# Altium schematic sheet ECAT RJ45.SchDoc
size 431 x 279 mm; SheetNumber: 7; PageSetup: Record=PageOptions|CenterHorizontal=True|CenterVertical=True|PrintScale=0.96|XCorrection=1.00|YCorrection=1.00|PrintKind=1|BorderSize=5000000|LeftOffset=0|BottomOffset=0|Orientation=2|PaperLength=1000|PaperWidth=1000|Scale=100|PaperSource=258|PrintQuality=600|MediaType=1|DitherType=10|PaperKind=11x17|PrintScaleMode=1; CopyrightDate: 20xx
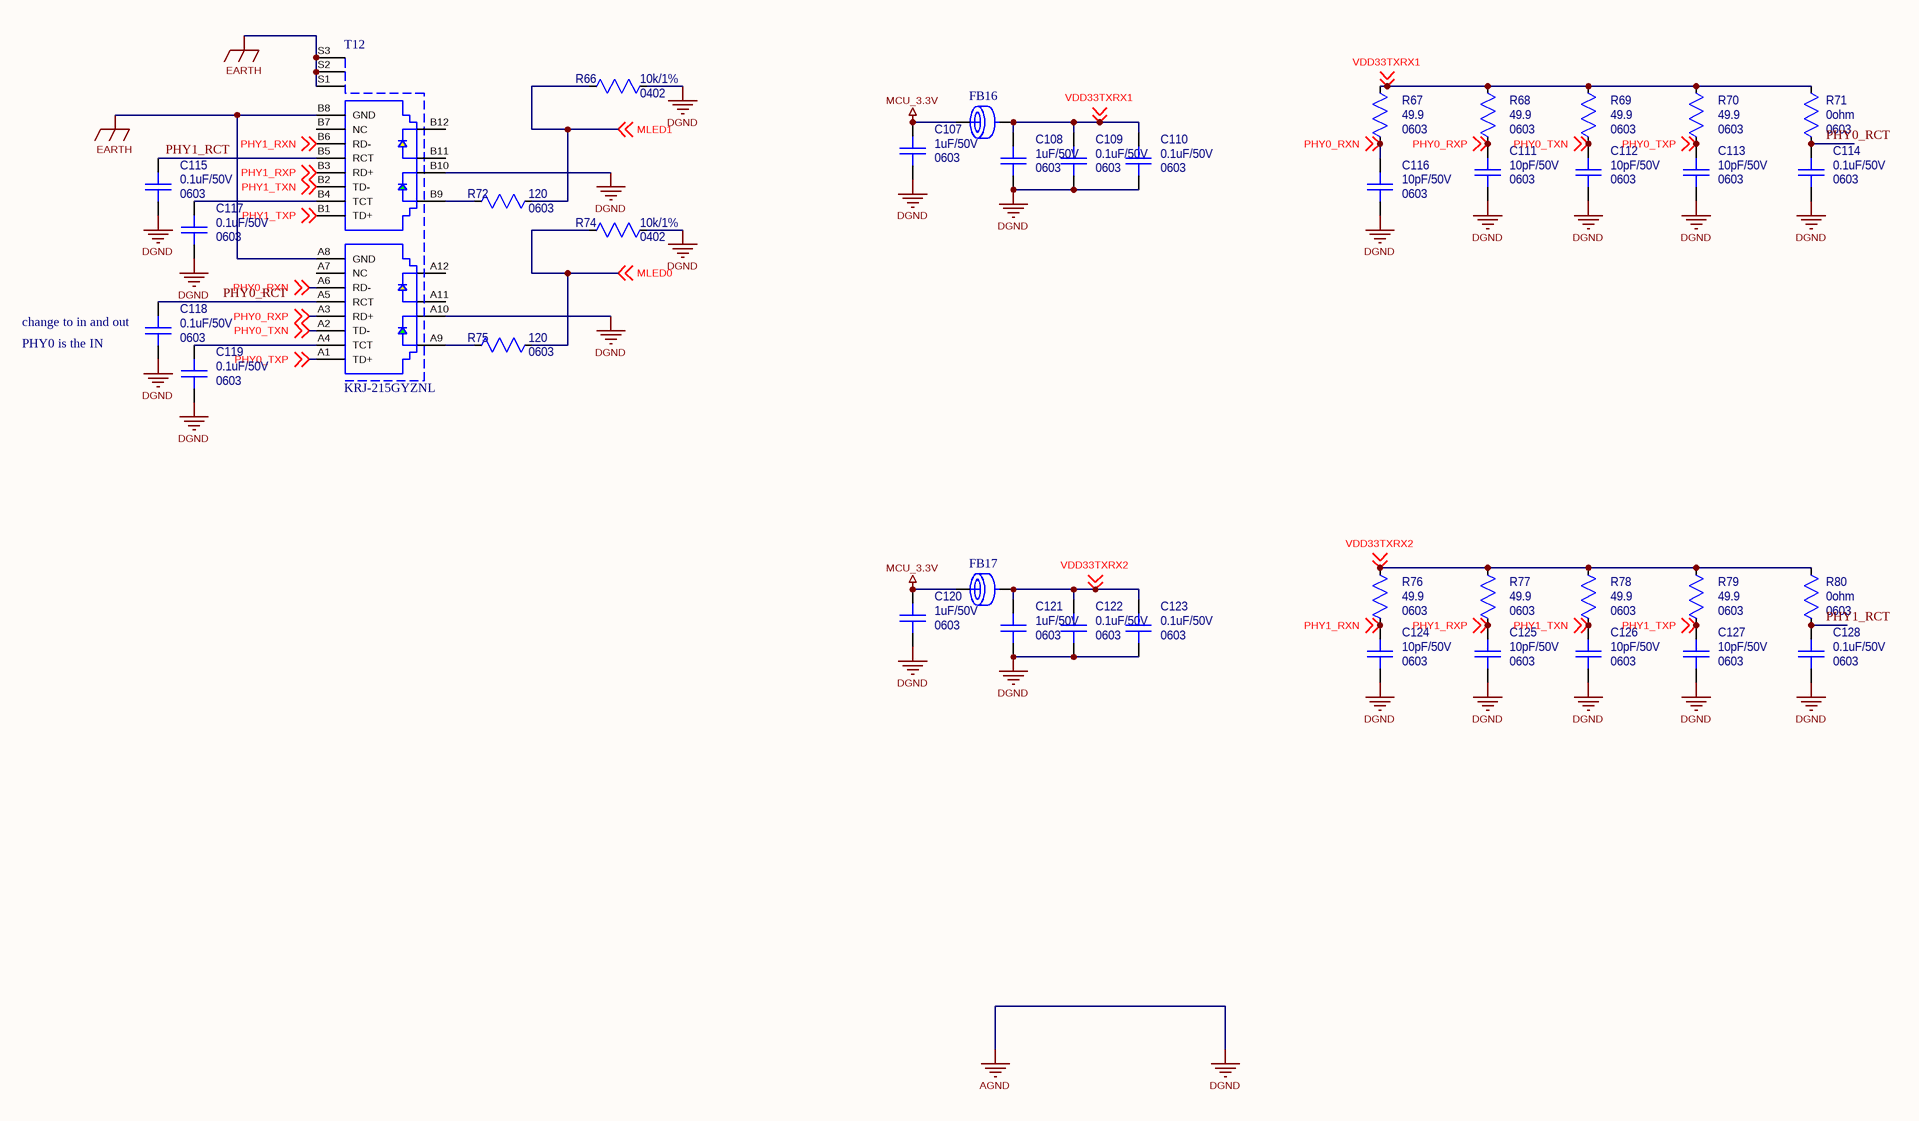
[diagram p0: ECAT RJ45.SchDoc]

## Parts
C107  Package: 0603  [CAPC1608X092N_0603]  (hidden comment: 1uF/50V)
C108  Package: 0603  [CAPC1608X092N_0603]  (hidden comment: 1uF/50V)
C109  Package: 0603  [CAPC1608X092N_0603]  (hidden comment: 0.1uF/50V)
C110  Package: 0603  [CAPC1608X092N_0603]  (hidden comment: 0.1uF/50V)
C111  Package: 0603  [CAPC1608X092N_0603]  (hidden comment: 10pF/50V)
C112  Package: 0603  [CAPC1608X092N_0603]  (hidden comment: 10pF/50V)
C113  Package: 0603  [CAPC1608X092N_0603]  (hidden comment: 10pF/50V)
C114  Package: 0603  [CAPC1608X092N_0603]  (hidden comment: 0.1uF/50V)
C115  Package: 0603  [CAPC1608X092N_0603]  (hidden comment: 0.1uF/50V)
C116  Package: 0603  [CAPC1608X092N_0603]  (hidden comment: 10pF/50V)
C117  Package: 0603  [CAPC1608X092N_0603]  (hidden comment: 0.1uF/50V)
C118  Package: 0603  [CAPC1608X092N_0603]  (hidden comment: 0.1uF/50V)
C119  Package: 0603  [CAPC1608X092N_0603]  (hidden comment: 0.1uF/50V)
C120  Package: 0603  [CAPC1608X092N_0603]  (hidden comment: 1uF/50V)
C121  Package: 0603  [CAPC1608X092N_0603]  (hidden comment: 1uF/50V)
C122  Package: 0603  [CAPC1608X092N_0603]  (hidden comment: 0.1uF/50V)
C123  Package: 0603  [CAPC1608X092N_0603]  (hidden comment: 0.1uF/50V)
C124  Package: 0603  [CAPC1608X092N_0603]  (hidden comment: 10pF/50V)
C125  Package: 0603  [CAPC1608X092N_0603]  (hidden comment: 10pF/50V)
C126  Package: 0603  [CAPC1608X092N_0603]  (hidden comment: 10pF/50V)
C127  Package: 0603  [CAPC1608X092N_0603]  (hidden comment: 10pF/50V)
C128  Package: 0603  [CAPC1608X092N_0603]  (hidden comment: 0.1uF/50V)
FB16  FBC0603  [FBC0603]  (value not drawn)
FB17  FBC0603  [FBC0603]  (value not drawn)
R66  Package: 0402  [RESC1005X040N_0402]  (hidden comment: 10k/1%)
R67  Package: 0603  [RESC1608X055N_0603]  (hidden comment: 49.9)
R68  Package: 0603  [RESC1608X055N_0603]  (hidden comment: 49.9)
R69  Package: 0603  [RESC1608X055N_0603]  (hidden comment: 49.9)
R70  Package: 0603  [RESC1608X055N_0603]  (hidden comment: 49.9)
R71  Package: 0603  [RESC1608X055N_0603]  (hidden comment: 0ohm)
R72  Package: 0603  [RESC1608X055N_0603]  (hidden comment: 120)
R74  Package: 0402  [RESC1005X040N_0402]  (hidden comment: 10k/1%)
R75  Package: 0603  [RESC1608X055N_0603]  (hidden comment: 120)
R76  Package: 0603  [RESC1608X055N_0603]  (hidden comment: 49.9)
R77  Package: 0603  [RESC1608X055N_0603]  (hidden comment: 49.9)
R78  Package: 0603  [RESC1608X055N_0603]  (hidden comment: 49.9)
R79  Package: 0603  [RESC1608X055N_0603]  (hidden comment: 49.9)
R80  Package: 0603  [RESC1608X055N_0603]  (hidden comment: 0ohm)
T12  KRJ-215GYZNL  [DGKYD-KRJ-211_V]

## Nets
AGND: C107.2 C108.2 C109.2 C110.2 C111.2 C112.2 C113.2 C114.2 C115.2 C116.2 C117.2 C118.2 C119.2 C120.2 C121.2 C122.2 C123.2 C124.2 C125.2 C126.2 C127.2 C128.2 R66.1 R74.1 T12.A10 T12.B10  [also labelled DGND]
EARTH: T12.A8(GND) T12.B8(GND) T12.S1(Shield) T12.S2(Shield) T12.S3(Shield)
MCU_3.3V: C107.1 C120.1 FB16.1 FB17.1
MLED0: R74.2 R75.1 ; off-sheet MLED0
MLED1: R66.2 R72.1 ; off-sheet MLED1
PHY0_RCT: C114.1 C118.1 R71.2 T12.A5(RCT)
PHY0_RXN: C116.1 R67.1 T12.A6(RD-) ; off-sheet PHY0_RXN
PHY0_RXP: C111.1 R68.1 T12.A3(RD+) ; off-sheet PHY0_RXP
PHY0_TXN: C112.1 R69.1 T12.A2(TD-) ; off-sheet PHY0_TXN
PHY0_TXP: C113.1 R70.1 T12.A1(TD+) ; off-sheet PHY0_TXP
PHY1_RCT: C115.1 C128.1 R80.2 T12.B5(RCT)
PHY1_RXN: C124.1 R76.1 T12.B6(RD-) ; off-sheet PHY1_RXN
PHY1_RXP: C125.1 R77.1 T12.B3(RD+) ; off-sheet PHY1_RXP
PHY1_TXN: C126.1 R78.1 T12.B2(TD-) ; off-sheet PHY1_TXN
PHY1_TXP: C127.1 R79.1 T12.B1(TD+) ; off-sheet PHY1_TXP
VDD33TXRX1: C108.1 C109.1 C110.1 FB16.2 R67.2 R68.2 R69.2 R70.2 R71.1 ; off-sheet VDD33TXRX1
VDD33TXRX2: C121.1 C122.1 C123.1 FB17.2 R76.2 R77.2 R78.2 R79.2 R80.1 ; off-sheet VDD33TXRX2
NetC117_1: C117.1 T12.B4(TCT)
NetC119_1: C119.1 T12.A4(TCT)
NetR72_2: R72.2 T12.B9
NetR75_2: R75.2 T12.A9

Not connected (* = marked no-connect by the designer): T12 A7(NC) A11 A12 B7(NC) B11 B12

## Notes on the sheet
- (near C118) change to in and out
- (near C118) PHY0 is the IN
- DWG. TITLE
- FILE NAME:
- OrangePrecision
- DWG. NO.
- REV.
- DATE PRINTED:
- ENG.
- DWN.
- DATE
- SHEET
- OF

## Library data of the parts
C107 C108 C120 C121 = Capacitor_0603: PartNumber: CL10A105KB8NNNC; Tolerance: [tol]; TempCo: [tempco]; Voltage Rating: [voltage]; Supplier 1: *; Supplier Part Number 1: *; Value: 1uF/50V; SupplierDescription: CAP CER 1UF 25V X5R 0603
C109 C110 C114 C122 C123 C128 = Capacitor_0402: PartNumber: CC0603KRX7R9BB104; Tolerance: [tol]; TempCo: [tempco]; Voltage Rating: [voltage]; Supplier 1: *; Supplier Part Number 1: *; Value: 0.1uF/50V; SupplierDescription: CAP CER 0.1UF 16V X7R 0402
C111-C113 C116 C124-C127 = Capacitor_0603: PartNumber: CC0603JRNPO9BN100; Tolerance: [tol]; TempCo: [tempco]; Voltage Rating: [voltage]; Supplier 1: *; Supplier Part Number 1: *; Value: 10pF/50V; SupplierDescription: CAP CER 10PF 50V C0G/NPO 0603
C115 C117-C119 = Capacitor_0603: PartNumber: CC0603KRX7R9BB104; Tolerance: [tol]; TempCo: [tempco]; Voltage Rating: [voltage]; Power Rating: *; Value: 0.1uF/50V; SupplierDescription: CAP CER 0.1UF 50V X7R 0603
FB16 FB17 = FBC0603: PartNumber: BLM18AG601SN1D; Value: 600 Ohms @ 100MHz; SupplierDescription: FERRITE BEAD 600 OHM 0603 1LN
R66 R74 = Resistor_0402: PartNumber: MR04X1002FTL; Power Rating: [power]; TempCo: [tempco]; Tolerance: tol; Value: 10k/1%; SupplierDescription: RES SMD 10K OHM 1% 1/10W 0402
R67-R70 R76-R79 = Resistor_0603: PartNumber: 0603WAF499JT5E; Power Rating: [power]; TempCo: [tempco]; Tolerance: tol; Value: 49.9; SupplierDescription: RES SMD 49.9 OHM 1% 1/10W 0603
R71 R80 = Resistor_0603: PartNumber: RC0603JR-070RL; Power Rating: [power]; TempCo: [tempco]; Tolerance: tol; Value: 0ohm; SupplierDescription: RES SMD 0 OHM JUMPER 1/10W 0603
R72 R75 = Resistor_0603: PartNumber: RC0603FR-07120RL; Power Rating: [power]; TempCo: [tempco]; Tolerance: tol; Value: 120; SupplierDescription: RES SMD 120 OHM 1% 1/10W 0603
T12 = KRJ-215GYZNL: Part Number: KRJ-211GYNL; Tab: Down; Port Number: 1x2; PoE: non-PoE; USB: No; Shield Tabs: Yes; Published Date: July 2019; Publisher: DGKYD; Operating Temperature: 0 to +70degC; Mounting Technology: THT; Packaging: Tube; Value: KRJ-215GYZNL; PartNumber: KRJ-215GYZNL